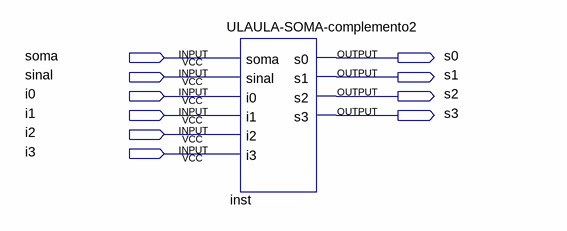
[diagram p0: schematic sheet]
// Quartus schematic aaaa.bdf as structural Verilog: 1 symbols, 10 pins
module aaaa (
  input  soma,
  input  sinal,
  input  i0,
  input  i1,
  input  i2,
  input  i3,
  output s0,
  output s1,
  output s2,
  output s3
);

  \ULAULA-SOMA-complemento2  inst (
    .soma(soma), .sinal(sinal), .i0(i0), .i1(i1), .i2(i2), .i3(i3), .s0(s0), .s1(s1), .s2(s2), .s3(s3));
endmodule
